# EAGLE schematic Octi (EAGLE 9.3.2)
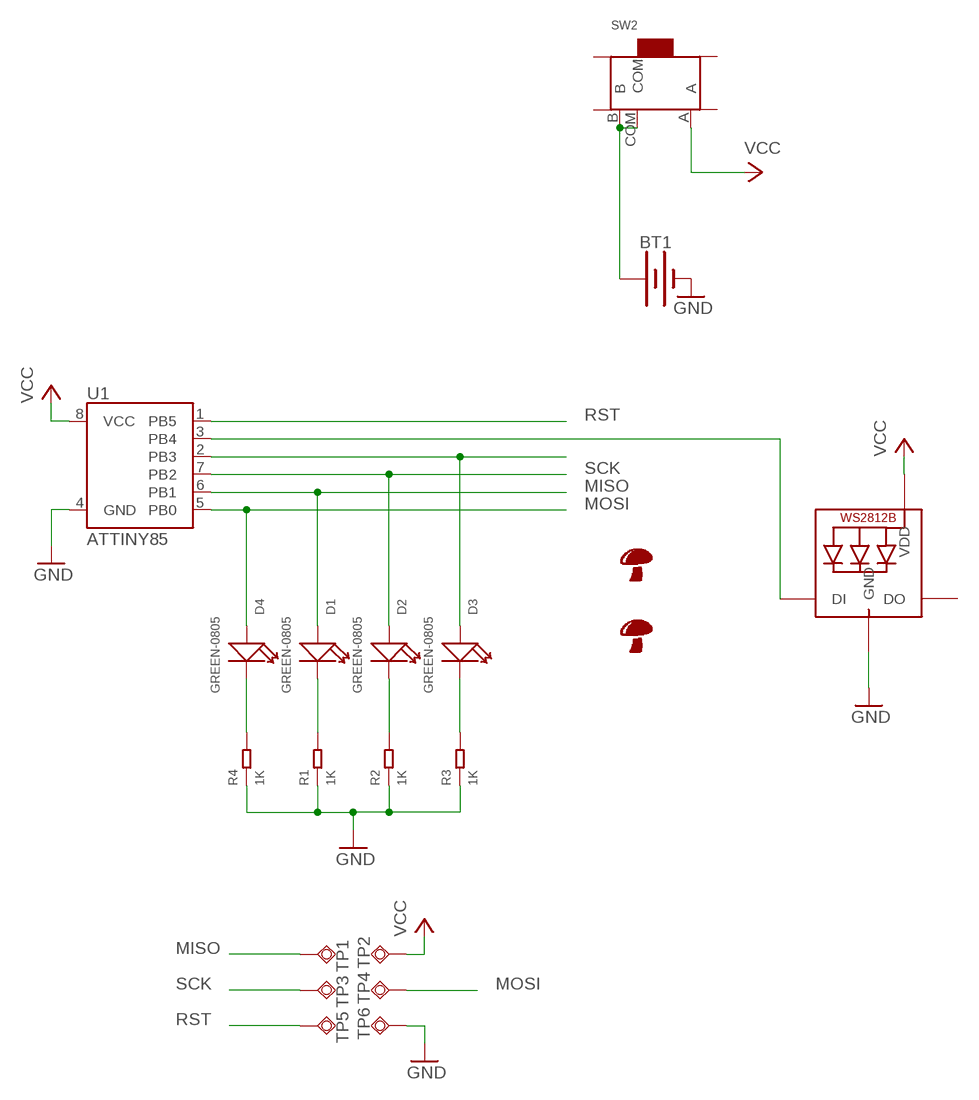
[diagram p0: schematic, sheet 1]

## Parts
BT1  BATTERY-20MM_SMD  [BATTCON_20MM]
D1  GREEN-0805  SMD-LED-CLEAR-GREEN(0805)  [LED-0805]
D2  GREEN-0805  SMD-LED-CLEAR-GREEN(0805)  [LED-0805]
D3  GREEN-0805  SMD-LED-CLEAR-GREEN(0805)  [LED-0805]
D4  GREEN-0805  SMD-LED-CLEAR-GREEN(0805)  [LED-0805]
LED1  WS2812B5050  [WS2812B]
R1  1K  SMD-RES-1K-1%-1/10W(0603)  [R0603]
R2  1K  SMD-RES-1K-1%-1/10W(0603)  [R0603]
R3  1K  SMD-RES-1K-1%-1/10W(0603)  [R0603]
R4  1K  SMD-RES-1K-1%-1/10W(0603)  [R0603]
SW2  SMD-TOGGLE-SWITCH-ON-ON(3+4P-6.7X2.7MM)MOD  [SW7-MOD]
TP1  TPSQTP12SQ  [TP12SQ]
TP2  TPSQTP12R  [TP12R]
TP3  TPSQTP12R  [TP12R]
TP4  TPSQTP12R  [TP12R]
TP5  TPSQTP12R  [TP12R]
TP6  TPSQTP12R  [TP12R]
U1  ATTINY85  [ATTINY85]
U$1  SHROOMBOTTOMSILK  [SHROOM_BS]
U$2  SHROOM5MM  [SHROOM]

## Nets
GND: BT1.2(-) LED1.3-GND(GND) R1.1 R2.1 R3.1 R4.1 TP6.TP U1.4(GND)
MISO: D1.+ TP1.TP U1.6(PB1)
MOSI: D4.+ TP4.TP U1.5(PB0)
N$1: BT1.1(+) SW2.B SW2.COM
N$2: D1.- R1.2
N$3: D2.- R2.2
N$6: D3.+ U1.2(PB3)
N$7: D4.- R4.2
N$8: D3.- R3.2
N$9: LED1.4-DIN(DI) U1.3(PB4)
RST: TP5.TP U1.1(PB5)
SCK: D2.+ TP3.TP U1.7(PB2)
VCC: LED1.1-VDD(VDD) SW2.A TP2.TP U1.8(VCC)
Unconnected: LED1.2-DOUT(DO) SW2.SS1 SW2.SS2 SW2.SS3 SW2.SS4

## Library data of the parts
BT1 = SparkFun-Batteries:BATTERY: Battery - Single Cell A variety of battery chemistries, sizes, and footprints. Device List: 20MM_PTH - Coin Cell Battery Holder - 20mm (PTH) <https://www.sparkfun.com/products/783> 20MM_PTH_KIT- Coin Cell battery Holder - 20 mm (PTH) <http://www.sparkfun.com/products/783>kit version with special mask 6.8MM_PTH - Coin Cell Battery Holder - 6.8MM(SMD) <https://www.digikey.com/product-detail/en/seiko-instruments/MS621FE-FL11E/728-1057-ND/1889208?WT.srch=1&gclid=CNOQ5a6LzdQCFZS2wAodXCkE0g> 12MM_SMD - Coin Cell Battery Holder - 12mm (SMD) <https://www.sparkfun.com/products/10592> 12MM_PTH - Coin Cell Battery Holder - 12mm (PTH) <https://www.sparkfun.com/products/7948> 20MM_SMD - 20mm Coin Cell Battery Holder (SMD) (2 legs) Used on the Big Time Watch Kit <https://www.sparkfun.com/products/11734> 20MM_SMD_4LEGS - Coin Cell Battery Holder - 20mm (SMD) <https://www.sparkfun.com/products/11892> 20MM_SMD_4LEGS_OVERPASTE - Coin Cell Battery Holder - 20mm (SMD) <https://www.sparkfun.com/products/11892> (Over-paste on the legs) 24.5MM_PTH - Coin Cell Battery Holder - 24.5mm (PTH) <https://www.sparkfun.com/products/8863> 9V - 9V Battery Holder - PC Mount Used on the SparkFun SparkPunk Sound Kit <https://www.sparkfun.com/products/11177> and SparkFun SparkPunk Sequencer Kit <https://www.sparkfun.com/products/12707> 18650 - Battery Holder - 18650 (PTH) <https://www.sparkfun.com/products/13113> AA - Battery Holder - 1xAA (PTH) <https://www.sparkfun.com/products/7949> AAA - Battery Holder - 1xAAA (PTH) <https://www.sparkfun.com/products/12718> AA_KIT - Battery Holder - 1xAA (PTH) <https://www.sparkfun.com/products/7949> Special kit package - pads only have exposed copper on one side of the board. AAA_KIT - Battery Holder - 1xAAA (PTH) <https://www.sparkfun.com/products/12718> Special kit package - pads only have exposed copper on one side of the board.; PROD_ID: BATT-11519
D1-D4 = OPL_Optoelectronics:SMD-LED-CLEAR-GREEN(0805): 304090057; MPN: 17-215SYGC/S530-E2/TR8
LED1 = adafruit:WS2812B
R1-R4 = OPL_Resistor:SMD-RES-1K-1%-1/10W(0603): 301011969; MPN: RC0603FR-071KL
SW2 = OPL_Switch:SMD-TOGGLE-SWITCH-ON-ON(3+4P-6.7X2.7MM): 311030001
TP1-TP6 = testpad:TPSQ: Test pad
U1 = SparkFun-IC-Microcontroller:ATTINY85; PROD_ID: IC-09092
U$1 U$2 = RobThePyro:SHROOM